# EAGLE design lps331-adapt (EAGLE 6.2)
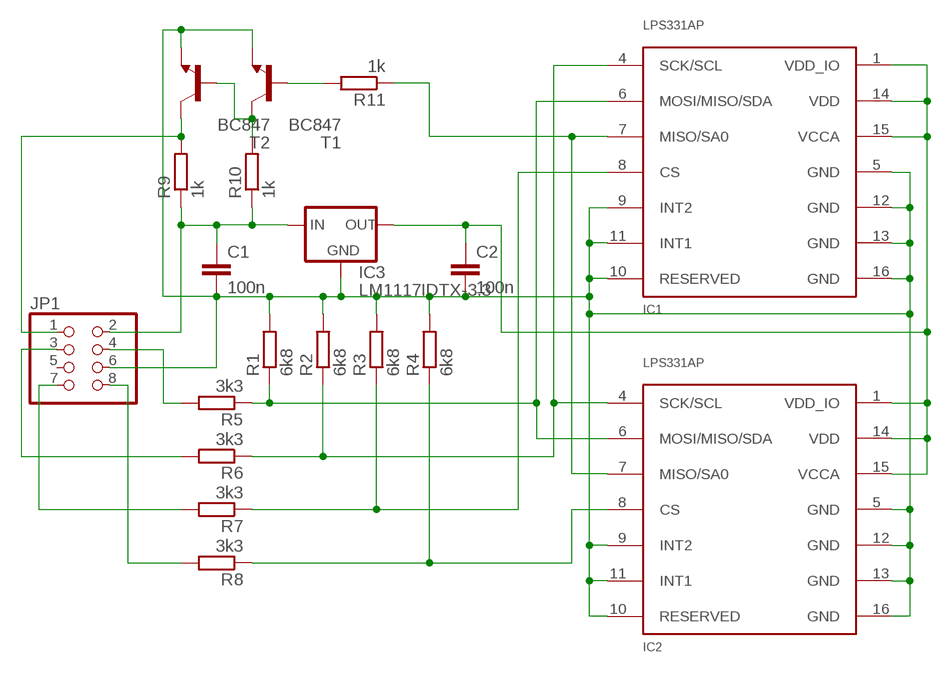
[diagram p0: schematic, sheet 1]

## Parts
C1  100n  C-EUC1206  [C1206]
C2  100n  C-EUC1206  [C1206]
IC1  LPS331AP  [HCLGA-16L]
IC2  LPS331AP  [HCLGA-16L]
IC3  LM1117IDTX-3.3  [TO252]
JP1  PINHD-2X4  [2X04]
R1  6k8  R-EU_R1206  [R1206]
R2  6k8  R-EU_R1206  [R1206]
R3  6k8  R-EU_R1206  [R1206]
R4  6k8  R-EU_R1206  [R1206]
R5  3k3  R-EU_R1206  [R1206]
R6  3k3  R-EU_R1206  [R1206]
R7  3k3  R-EU_R1206  [R1206]
R8  3k3  R-EU_R1206  [R1206]
R9  1k  R-EU_R1206  [R1206]
R10  1k  R-EU_R1206  [R1206]
R11  1k  R-EU_R1206  [R1206]
T1  BC847  [SOT23]
T2  BC847  [SOT23]

## Nets
+3.3V: C2.1 IC1.1(VDD_IO) IC1.14(VDD) IC1.15(VCCA) IC2.1(VDD_IO) IC2.14(VDD) IC2.15(VCCA) IC3.TAB(OUT)
+5V: C1.1 IC3.2(IN) JP1.2 R9.1 R10.1
GND: C1.2 C2.2 IC1.5(GND) IC1.9(INT2) IC1.10(RESERVED) IC1.11(INT1) IC1.12(GND) IC1.13(GND) IC1.16(GND) IC2.5(GND) IC2.9(INT2) IC2.10(RESERVED) IC2.11(INT1) IC2.12(GND) IC2.13(GND) IC2.16(GND) IC3.1(GND) JP1.6 R1.2 R2.2 R3.2 R4.2 T1.2(E) T2.2(E)
N$1: IC1.6(MOSI/MISO/SDA) IC2.6(MOSI/MISO/SDA) R1.1 R5.1
N$2: IC1.7(MISO/SA0) IC2.7(MISO/SA0) R11.1
N$4: JP1.4 R5.2
N$5: JP1.3 R6.2
N$6: JP1.7 R7.2
N$7: JP1.8 R8.2
N$9: IC1.4(SCK/SCL) IC2.4(SCK/SCL) R2.1 R6.1
N$10: IC1.8(CS) R3.1 R7.1
N$11: IC2.8(CS) R4.1 R8.1
N$12: R10.2 T1.3(C) T2.1(B)
N$13: JP1.1 R9.2 T2.3(C)
N$15: R11.2 T1.1(B)
Unconnected: JP1.5

## Library data of the parts
C1 C2 = rcl:C-EU: CAPACITOR, European symbol
IC1 IC2 = LPS331AP:LPS331AP
IC3 = lm1117:LM1117IDTX-*
JP1 = pinhead:PINHD-2X4: PIN HEADER
R1-R11 = rcl:R-EU_: RESISTOR, European symbol
T1 T2 = transistor:BC847: NPN TRANSISTOR

## Board
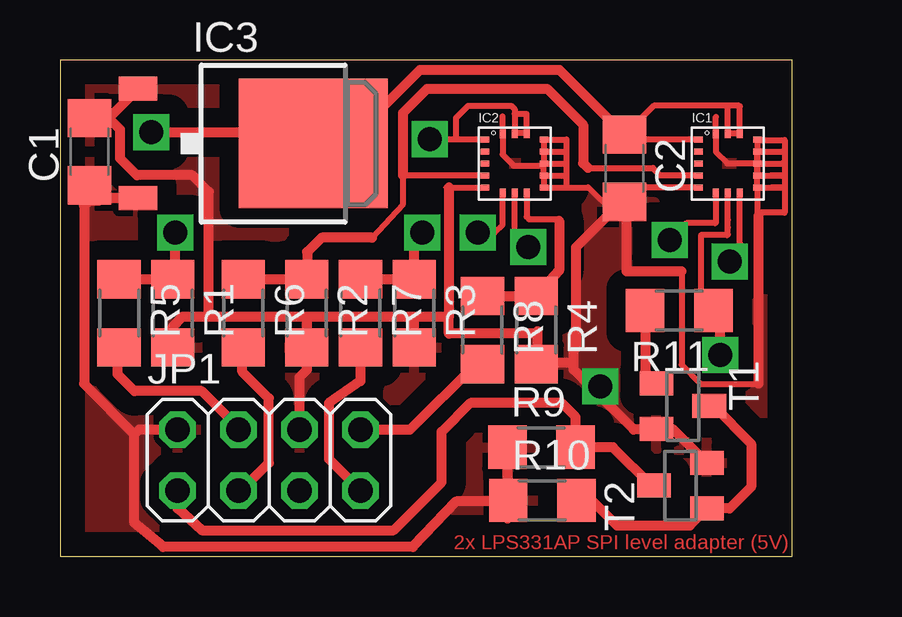
[diagram p1: board, top side]
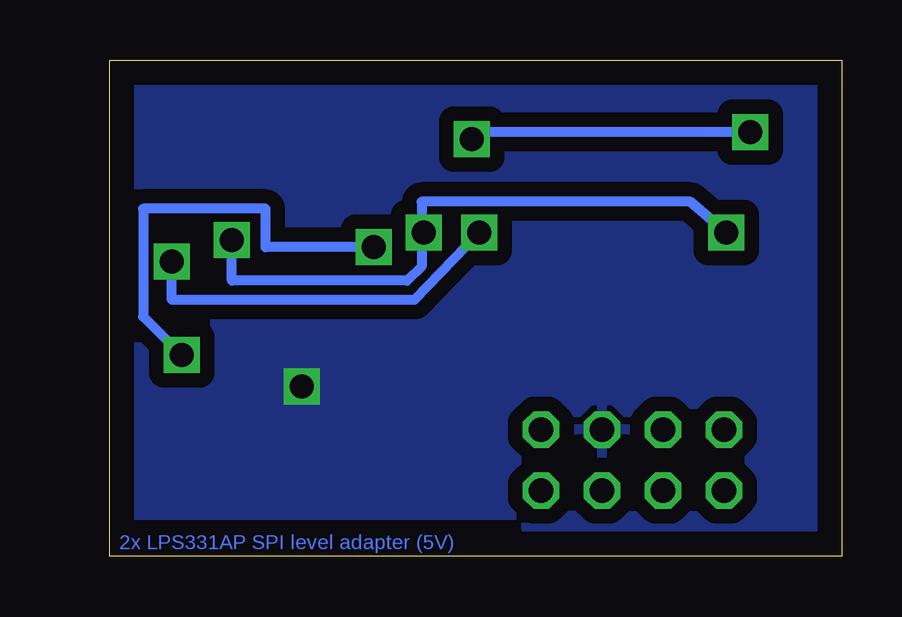
[diagram p2: board, bottom side, seen from below]

Size 30.5 x 20.7 mm. Coordinates in mm from the lower left corner, seen from the top.
Outline: 0,0 30.5,0 30.5,20.7 0,20.7 0,0
Copper layers (1*16): Top 0.035mm / dielectric 1.5mm / Bottom 0.035mm
Design rules: minimum track width 10mil, minimum drill 24mil, track to track 8mil, track to pad 8mil, pad to pad 8mil, via to via 8mil, smd to smd 8mil, copper to edge 40mil, drill to drill 8mil, minimum pad ring 10mil, minimum via ring 8mil, stop-mask expansion 4mil, vias tented up to drill 0mil, thermal gap 10mil

### Footprints (pad centres in the part's own frame; a part is rotated, then mirrored left to right if it is on the bottom)
C1206 = smd 1.6 x 1.8: 1 -1.4,0; 2 1.4,0
HCLGA-16L = smd 0.35 x 0.25: 1 -1.225,1; 2 -1.225,0.5; 3 -1.225,0; 4 -1.225,-0.5; 5 -1.225,-1; 9 1.225,-1; 10 1.225,-0.5; 11 1.225,0; 12 1.225,0.5; 13 1.225,1 | smd 0.25 x 0.35: 6 -0.5,-1.225; 7 0,-1.225; 8 0.5,-1.225; 14 0.5,1.225; 15 0,1.225; 16 -0.5,1.225
TO252 = smd 1 x 1.6: 1 -2.28,-4.8; 2 2.28,-4.8 | smd 5.4 x 6.2: TAB 0,2.5
2X04 = drill 1.016 octagon: 1 -3.81,-1.27; 2 -3.81,1.27; 3 -1.27,-1.27; 4 -1.27,1.27; 5 1.27,-1.27; 6 1.27,1.27; 7 3.81,-1.27; 8 3.81,1.27
R1206 = smd 1.6 x 1.803: 1 -1.422,0; 2 1.422,0
SOT23 = smd 1 x 1.4: 1 -0.95,-1.1; 2 0.95,-1.1; 3 0,1.1

### Placement (x,y rotation side)
C1  1.23,16.88 90 top
C2  23.52,16.19 270 top
IC1  27.83,16.39 0 top
IC2  18.94,16.39 0 top
IC3  8.05,17.22 270 top
JP1  8.71,4.02 0 top
R1  4.7,10.14 270 top
R2  10.28,10.14 270 top
R3  14.76,10.14 270 top
R4  19.84,9.44 270 top
R5  2.46,10.14 270 top
R6  7.64,10.14 270 top
R7  12.52,10.14 270 top
R8  17.6,9.44 270 top
R9  20.06,4.56 0 top
R10  20.1,2.34 0 top
R11  25.8,10.26 180 top
T1  25.95,6.27 270 top
T2  25.85,2.96 90 top

### Tracks (layer width: path | path; a pad name or v marks a point on that pad's centre or on a via)
+3.3V  (via drill 1)
  Top 0.254: IC1.14 28.33,18.77 28.3,18.8 27.88,18.8 | 27.88,18.8 24.73,18.8 C2.1 23.72,17.39 IC1.1 | 16.51,17.39 16.5,17.4 16.5,18.3 17,18.8 18.8,18.8 18.94,18.66 18.94,18.45 | 16.51,17.39 v15.41,17.39 v15.4,17.4 | IC2.1 16.51,17.39 | 18.94,18.45 IC2.15 | IC2.14 19.44,18.45 18.94,18.45 | IC1.15 27.83,18.75 27.88,18.8
  Top 0.406: IC3.TAB 11.62,16.92 15,20.3 20.81,20.3 C2.1 | 10.37,17.4 IC3.TAB | v3.8,17.7 10.07,17.7 IC3.TAB
  Bottom 0.406: v3.8,17.7 15.1,17.7 v15.4,17.4
+5V
  Top 0.254: 3.3,14.7 IC3.2 | 1.2,15.5 C1.1
  Top 0.406: 18.64,1.58 R10.1 18.64,2.38 R9.1 18.64,2.64 18.3,2.3 16.5,2.3 14.7,0.4 4.3,0.4 3.1,1.4 3.1,5.1 | 3.1,5.1 3.3,5.3 JP1.2 | C1.1 1.23,14.85 | IC3.2 1.74,14.94 1.65,14.85 1.23,14.85 | 3.1,5.1 1,7.2 1,14.62 1.23,14.85
  pour Top (isolate 0.813): -0.1,21 30.5,21.1 30.5,-0.3 -0.3,-0.4 -0.3,2
GND  (via drill 1)
  Top 0.254: 24,14.6 24,14.7 | 24,14.7 24,15.4 24.01,15.39 25.91,15.39 | 24.9,5.3 T1.2 24.48,5.32 | 26.9,4 T2.2 | IC1.13 IC1.12 | IC1.12 IC1.11 | IC1.11 IC1.10 | 29.1,14.2 29.05,14.24 IC1.9 IC1.10 | IC1.5 25.91,15.39 | 25.91,15.39 25.9,15.4 | IC1.16 27.33,16.87 27.8,16.4 IC1.11 | IC1.10 IC1.12 | 24,14.7 23.91,14.79 C2.2 23.13,14.4 23,14.4 22.01,15.39 IC2.9 IC2.10 IC2.11 | IC2.16 18.44,16.76 18.9,16.3 20.07,16.3 IC2.11 | IC2.13 IC2.12 IC2.11 | 16.1,15.4 16.1,15.39 16.2,15.39 IC2.5 | 25.9,11.9 25.9,8 26.7,7.2 29.1,7.2
  Top 0.406: 29.1,14.2 29.1,7.2 | 24.48,5.32 24.48,5.42 | T2.2 25.56,5.3 24.9,5.3 23.9,5.3 22.1,7.1 | C1.2 2.03,18.28 | JP1.6 9.98,7.48 10.3,7.8 10.3,8.7 | 10.3,8.7 R2.2 | R1.2 4.7,9.6 5.1,10 6.2,10 | 6.2,10 10.3,10 | 10.3,10 14.9,10 | 14.9,10 16.2,10 | 10.3,8.7 10.3,10 | 24.83,5.3 T1.2 | R3.2 14.76,9.86 14.9,10 | 23,14.4 21.5,12.9 21.5,8.7 21.48,8.72 21.4,8.72 21.4,8.1 | 21.4,8.1 21.4,7.8 22.1,7.1 | 16.2,15.4 16.2,15.39 16.2,10 | 2.03,18.28 IC3.1 | C2.2 23.6,14.71 23.6,11.9 25.9,11.9 | 21.4,8.1 19.92,8.1 R4.2 19.9,8.08 19.9,9.4 19.8,9.3 16.2,9.3 16.2,10 | 6.2,10 6.2,15.2 5.5,15.9 3.2,15.9 2.5,16.6 2.5,17.81 2.03,18.28 | 22.1,7.1 v22.5,7.1
  pour Top (isolate 0.813): -0.1,21.1 30.6,21.1 30.6,-0.3 -0.3,-0.3 -0.3,2
  pour Bottom (isolate 0.61): 0,20.9 30.6,20.8 30.6,0 -0.1,0.1 -0.1,2.7
N$1  (via drill 1)
  Top 0.254: IC2.6 18.44,13.84 18.1,13.5 v17.4,13.5 | IC1.6 27.33,13.93 27.3,13.9 26.1,13.9 v25.4,13.2
  Top 0.406: R5.1 R1.1 4.8,11.66 v4.8,13.5
  Bottom 0.406: v4.8,13.5 6.3,14.8 17.5,14.8 17.5,13.6 v17.4,13.5 17.5,13.4 17.5,12.1 18.1,11.5 25.4,11.5 v25.4,13.2
N$2  (via drill 1)
  Top 0.254: 27.3,9.5 27.45,9.65 27.8,10 | IC1.7 27.83,14.04 27.83,13.73 27.83,13.43 27.8,13.4 26.7,13.4 26.7,10.4 | v19.5,12.9 18.94,13.46 IC2.7
  Top 0.406: 26.7,10.4 26.84,10.26 R11.1 27.5,9.98 27.5,9.7 | v27.5,8.4 27.5,9.7 | 27.5,9.7 27.45,9.65
  Bottom 0.406: v19.5,12.9 24,12.9 24,14.5 29.1,14.5 29.1,10 v27.5,8.4
N$3
  Top 0.254: 20.19,17.39 21.09,17.39 21.09,16.9 21.09,16.89 | 21.09,16.89 21.09,15.39 | 20.15,16.89 21.09,16.89
N$4
  Top 0.406: JP1.4 7.44,5.36 5.9,6.9 3.1,6.9 2.4,7.6 2.4,8.66 R5.2
N$5
  Top 0.406: JP1.3 7.55,2.75 8.7,3.9 8.7,6.6 7.6,7.7 7.6,8.68 R6.2
N$6
  Top 0.406: R7.2 12.52,7.32 11.2,6.4 11.2,4.07 JP1.7
N$7
  Top 0.406: JP1.8 14.59,5.29 17.32,8.02 R8.2
N$8
  Top 0.254: 20.15,16.39 21.08,16.39
N$9
  Top 0.254: 13,13.3 14.3,14.7 14.3,15.9 14.31,15.89 IC2.4 | 22,16.2 24.7,16.2 25.01,15.89 IC1.4
  Top 0.406: R6.1 R2.1 10.3,11.58 10.3,12.7 10.9,13.3 13,13.3 | 14.3,15.9 14.3,18.5 15.3,19.5 20.3,19.5 21.8,18 21.8,16.4 22,16.2
N$10  (via drill 1)
  Top 0.254: v27.9,12.3 28.33,13.07 IC1.8
  Top 0.406: R7.1 R3.1 14.76,13.06 v15.1,13.5
  Bottom 0.406: v15.1,13.5 17.8,10.7 27.9,10.7 v27.9,12.3
N$11
  Top 0.254: IC2.8 19.44,14.17 19.54,14.06 20.73,14.06 20.8,14
  Top 0.406: R8.1 R4.1 20.8,11.92 20.8,14
N$12
  Top 0.406: T1.3 27.23,6.27 28.8,4.7 28.8,2.9 27.9,2 T2.1 26.24,1.3 23.2,1.3 22.16,2.34 R10.2
N$13
  Top 0.254: 24.7,2.9 T2.3
  Top 0.406: 24.7,2.9 23.04,4.56 R9.2 21.48,5.82 20.9,6.4 17.1,6.4 15.9,5.2 15.9,3.1 13.9,1.1 5.9,1.1 4.9,2 JP1.1
N$14
  Top 0.254: 20.24,15.88 21.04,15.88 21.04,15.89
N$15
  Top 0.406: R11.2 24.38,7.69 T1.1
N$16
  Top 0.254: 18.95,17.67 19.36,17.67 19.36,17.68
N$17
  Top 0.254: 27.84,17.66 28.27,17.66
N$18
  Top 0.254: 29.07,17.37 30.2,17.37 30.2,14.33 29.13,14.33 29.13,14.32
N$19
  Top 0.254: 29.18,16.89 30.1,16.89
N$20
  Top 0.254: 29.12,16.39 30.09,16.39
N$21
  Top 0.254: 29.23,15.89 30.1,15.89 29.6,15.88
N$22
  Top 0.254: 29.17,15.39 30.06,15.39 29.61,15.38
N$23
  Top 0.254: 18.44,17.7 18.44,18.35
N$24
  Top 0.254: 27.32,17.71 27.33,17.71 27.33,18.33

### Text on the board
Top: 2x LPS331AP SPI level adapter (5V)
Bottom: 2x LPS331AP SPI level adapter (5V)